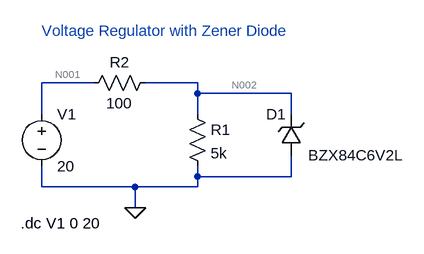
[diagram p0: schematic Voltage regulator with zener.asc]
Voltage regulator with zener.asc, the LTspice schematic file:
Version 4
SHEET 1 880 680
WIRE 128 112 48 112
WIRE 288 112 208 112
WIRE 288 128 288 112
WIRE 432 128 288 128
WIRE 48 160 48 112
WIRE 288 160 288 128
WIRE 432 160 432 128
WIRE 288 256 288 240
WIRE 432 256 432 224
WIRE 432 256 288 256
WIRE 48 272 48 240
WIRE 192 272 48 272
WIRE 288 272 288 256
WIRE 288 272 192 272
WIRE 192 304 192 272
FLAG 192 304 0
SYMBOL res 272 144 R0
SYMATTR InstName R1
SYMATTR Value 5k
SYMBOL voltage 48 144 R0
WINDOW 123 0 0 Left 0
WINDOW 39 0 0 Left 0
SYMATTR InstName V1
SYMATTR Value 20
SYMBOL zener 448 224 R180
WINDOW 0 24 64 Left 2
WINDOW 3 -157 1 Left 2
SYMATTR InstName D1
SYMATTR Value BZX84C6V2L
SYMATTR Description Diode
SYMATTR Type diode
SYMBOL res 112 128 R270
WINDOW 0 32 56 VTop 2
WINDOW 3 0 56 VBottom 2
SYMATTR InstName R2
SYMATTR Value 100
TEXT 48 32 Left 2 ;Voltage Regulator with Zener Diode
TEXT 16 328 Left 2 !.dc V1 0 20

The netlist it stands for:
* Voltage regulator with zener.asc
R1 N002 0 5k
V1 N001 0 20
D1 0 N002 BZX84C6V2L
R2 N001 N002 100
.model D D
.lib standard.dio
* Voltage Regulator with Zener Diode
.dc V1 0 20
.backanno
.end

* Results of the author's LTspice run, read from the files saved beside the schematic
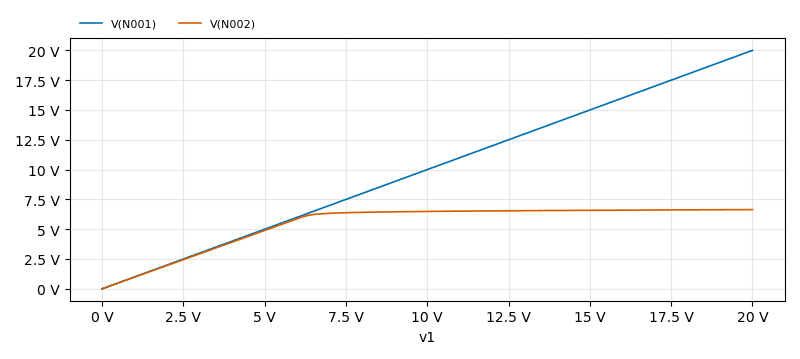
[diagram p1: DC transfer characteristic of Voltage regulator with zener.asc, plotted from the saved traces]
* DC transfer characteristic, 1 run:
*   V(N001): 0 V at v1=0 V, 20 V at v1=20 V, min 0 V, max 20 V
*   V(N002): 0 V at v1=0 V, 6.645 V at v1=20 V, min 0 V, max 6.645 V